# EAGLE design power-distribution (EAGLE 6.4)
AUTHOR: Ryan Julian (ryanjulian@berkeley.edu); DESIGN_NAME: Exynos Backpack; REVISION: A; YEAR: 2013
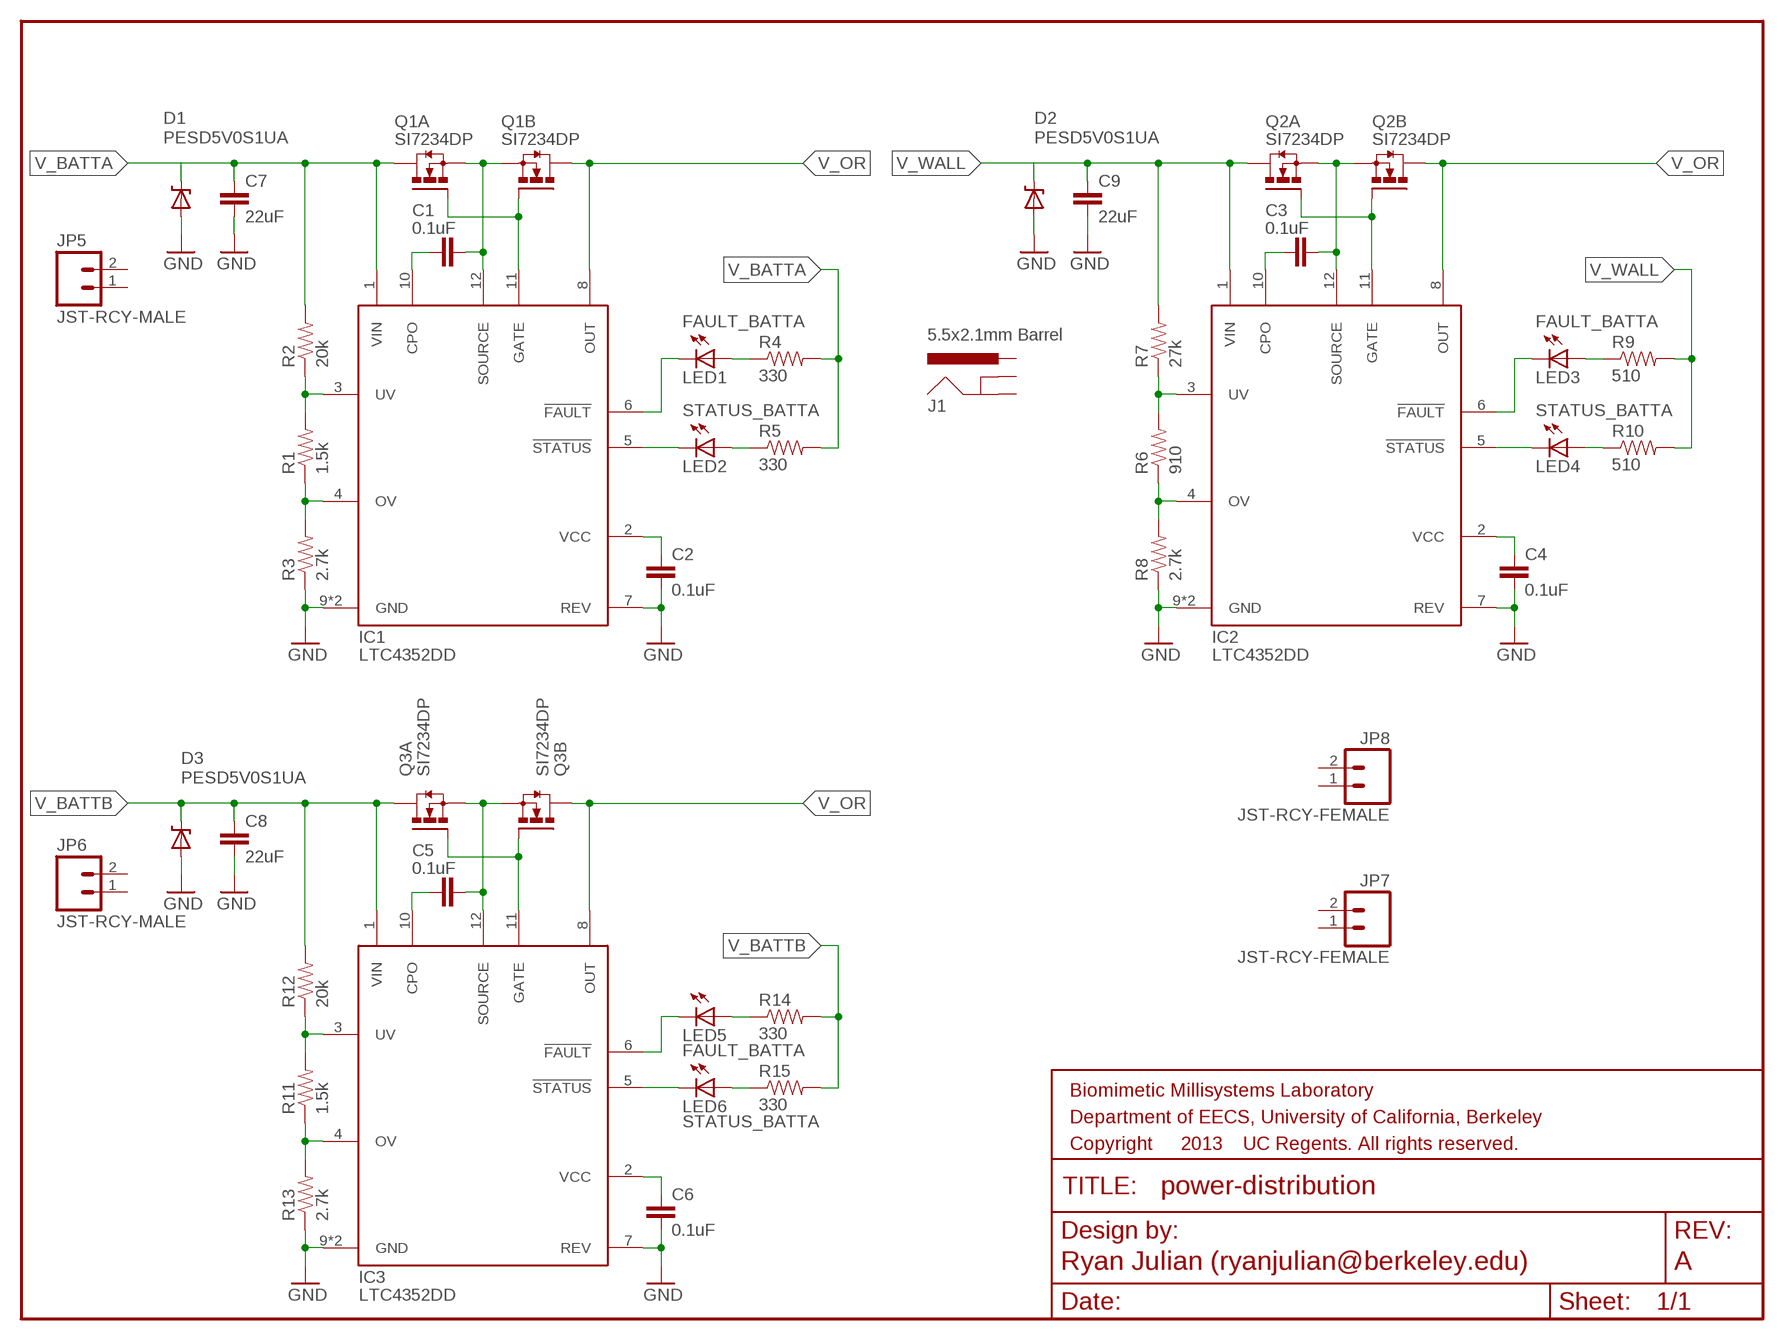
[diagram p0: schematic, sheet 1]

## Parts
C1  0.1uF  CAP0402-CAP  [0402-CAP]
C2  0.1uF  CAP0402-CAP  [0402-CAP]
C3  0.1uF  CAP0402-CAP  [0402-CAP]
C4  0.1uF  CAP0402-CAP  [0402-CAP]
C5  0.1uF  CAP0402-CAP  [0402-CAP]
C6  0.1uF  CAP0402-CAP  [0402-CAP]
C7  22uF  CAP0603-CAP  [0603-CAP]
C8  22uF  CAP0603-CAP  [0603-CAP]
C9  22uF  CAP0603-CAP  [0603-CAP]
D1  PESD5V0S1UA  [SOD-323]
D2  PESD5V0S1UA  [SOD-323]
D3  PESD5V0S1UA  [SOD-323]
IC1  LTC4352DD  [DFN-12-3X3-DD]
IC2  LTC4352DD  [DFN-12-3X3-DD]
IC3  LTC4352DD  [DFN-12-3X3-DD]
J1  5.5x2.1mm Barrel  POWER_JACKSMD  [POWER_JACK_SMD]
JP5  JST-RCY-MALE  [JST-RCY-MALE]
JP6  JST-RCY-MALE  [JST-RCY-MALE]
JP7  JST-RCY-FEMALE  [JST-RCY-FEMALE]
JP8  JST-RCY-FEMALE  [JST-RCY-FEMALE]
LED1  FAULT_BATTA  LED0603  [LED-0603]
LED2  STATUS_BATTA  LED0603  [LED-0603]
LED3  FAULT_BATTA  LED0603  [LED-0603]
LED4  STATUS_BATTA  LED0603  [LED-0603]
LED5  FAULT_BATTA  LED0603  [LED-0603]
LED6  STATUS_BATTA  LED0603  [LED-0603]
Q1  SI7234DP  [POWERPAK-SO-8-DUAL]
Q2  SI7234DP  [POWERPAK-SO-8-DUAL]
Q3  SI7234DP  [POWERPAK-SO-8-DUAL]
R1  1.5k  RESISTOR0402-RES  [0402-RES]
R2  20k  RESISTOR0402-RES  [0402-RES]
R3  2.7k  RESISTOR0402-RES  [0402-RES]
R4  330  RESISTOR0402-RES  [0402-RES]
R5  330  RESISTOR0402-RES  [0402-RES]
R6  910  RESISTOR0402-RES  [0402-RES]
R7  27k  RESISTOR0402-RES  [0402-RES]
R8  2.7k  RESISTOR0402-RES  [0402-RES]
R9  510  RESISTOR0402-RES  [0402-RES]
R10  510  RESISTOR0402-RES  [0402-RES]
R11  1.5k  RESISTOR0402-RES  [0402-RES]
R12  20k  RESISTOR0402-RES  [0402-RES]
R13  2.7k  RESISTOR0402-RES  [0402-RES]
R14  330  RESISTOR0402-RES  [0402-RES]
R15  330  RESISTOR0402-RES  [0402-RES]

## Nets
GND: C2.2 C4.2 C6.2 C7.2 C8.2 C9.2 D1.2(A) D2.2(A) D3.2(A) IC1.7(REV) IC1.9(GND) IC1.PAD(GND) IC2.7(REV) IC2.9(GND) IC2.PAD(GND) IC3.7(REV) IC3.9(GND) IC3.PAD(GND) R3.1 R8.1 R13.1
N$1: C1.2 IC1.12(SOURCE) Q1.1(A:S) Q1.3(B:S)
N$2: IC1.11(GATE) Q1.2(A:G) Q1.4(B:G)
N$4: C1.1 IC1.10(CPO)
N$6: IC1.3(UV) R1.2 R2.1
N$7: IC1.4(OV) R1.1 R3.2
N$8: C2.1 IC1.2(VCC)
N$9: IC1.6(!FAULT) LED1.C
N$10: IC1.5(!STATUS) LED2.C
N$11: LED2.A R5.1
N$12: LED1.A R4.1
N$13: C3.2 IC2.12(SOURCE) Q2.1(A:S) Q2.3(B:S)
N$14: IC2.11(GATE) Q2.2(A:G) Q2.4(B:G)
N$15: C3.1 IC2.10(CPO)
N$18: IC2.3(UV) R6.2 R7.1
N$19: IC2.4(OV) R6.1 R8.2
N$20: C4.1 IC2.2(VCC)
N$21: IC2.6(!FAULT) LED3.C
N$22: IC2.5(!STATUS) LED4.C
N$23: LED4.A R10.1
N$24: LED3.A R9.1
N$25: C5.2 IC3.12(SOURCE) Q3.1(A:S) Q3.3(B:S)
N$26: IC3.11(GATE) Q3.2(A:G) Q3.4(B:G)
N$27: C5.1 IC3.10(CPO)
N$30: IC3.3(UV) R11.2 R12.1
N$31: IC3.4(OV) R11.1 R13.2
N$32: C6.1 IC3.2(VCC)
N$33: IC3.6(!FAULT) LED5.C
N$34: IC3.5(!STATUS) LED6.C
N$35: LED6.A R15.1
N$36: LED5.A R14.1
V_BATTA: C7.1 D1.1(C) IC1.1(VIN) Q1.7+8(A:D) R2.2 R4.2 R5.2
V_BATTB: C8.1 D3.1(C) IC3.1(VIN) Q3.7+8(A:D) R12.2 R14.2 R15.2
V_OR: IC1.8(OUT) IC2.8(OUT) IC3.8(OUT) Q1.5+6(B:D) Q2.5+6(B:D) Q3.5+6(B:D)
V_WALL: C9.1 D2.1(C) IC2.1(VIN) Q2.7+8(A:D) R7.2 R9.2 R10.2
Unconnected: J1.GND(GNDBREAK) J1.P$4(GND) J1.VIN0(PWR) JP5.1 JP5.2 JP6.1 JP6.2 JP7.1 JP7.2 JP8.1 JP8.2

## Library data of the parts
C1-C9 = biomimetic:CAP: Capacitor Standard 0603 ceramic capacitor, and 0.1" leaded capacitor.
D1-D3 = biomimetic:PESD5V0S1UA: NXP PESD5V0S1UA Unidirectional ESD protection for transient voltage suppression for 5V devices Digi-Key P/N: 568-7351-1-ND
IC1-IC3 = biomimetic:LTC4352: Low Voltage Ideal Diode Controller with Monitoring
J1 = biomimetic:POWER_JACK: Power Jack This is the standard 5.5mm barrel jack for power. The PTH is the most common, proven, reliable, footprint. The Slot footprint only works if the mill layer is transmitted to the PCB fab house so be warned. Spark Fun Electronics SKU : PRT-00119 SMT: CONN-08106 Mating wall wart : TOL-00298 (and others); PROD_ID: CONN-08106
JP5 JP6 = biomimetic:JST-RCY-MALE: JST RCY male pigtail connector
JP7 JP8 = biomimetic:JST-RCY-FEMALE
LED1-LED6 = biomimetic:LED: LEDs Standard schematic elements and footprints for 5mm, 3mm, 1206, and 0603 sized LEDs. 5mm - Spark Fun Electronics SKU : COM-00529 (and others)
Q1-Q3 = biomimetic:SI7234DP: Vishay Siliconix Dual N-Channel 12-V (D-S) MOSFET
R1-R15 = biomimetic:RESISTOR: Resistor Basic schematic elements and footprints for 0603, 1206, and PTH resistors.

## Net classes
1 sup: width 0.254 mm

## Board
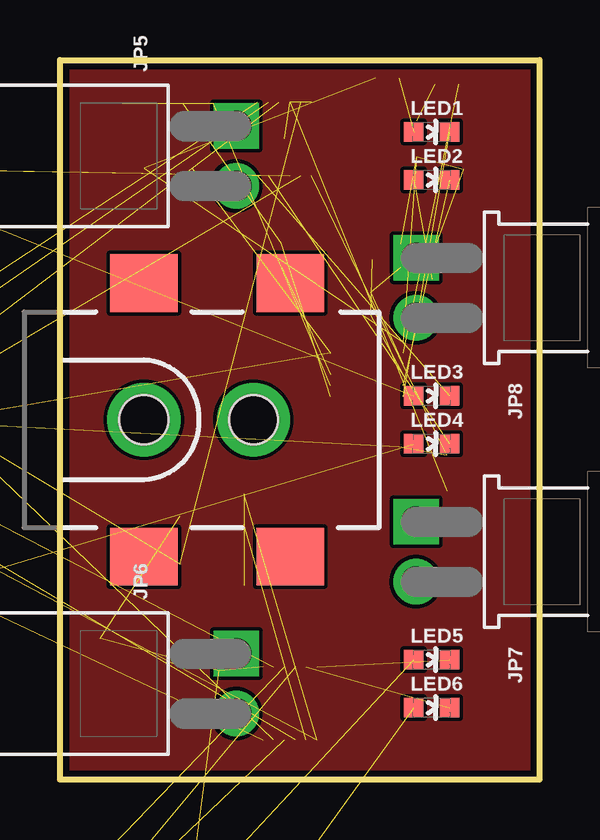
[diagram p1: board, top side]
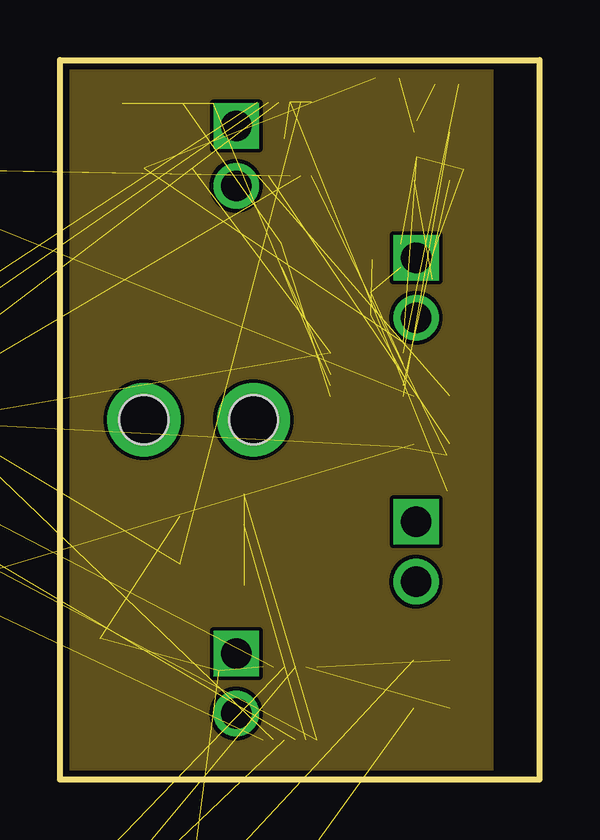
[diagram p2: board, inner layer Ground]
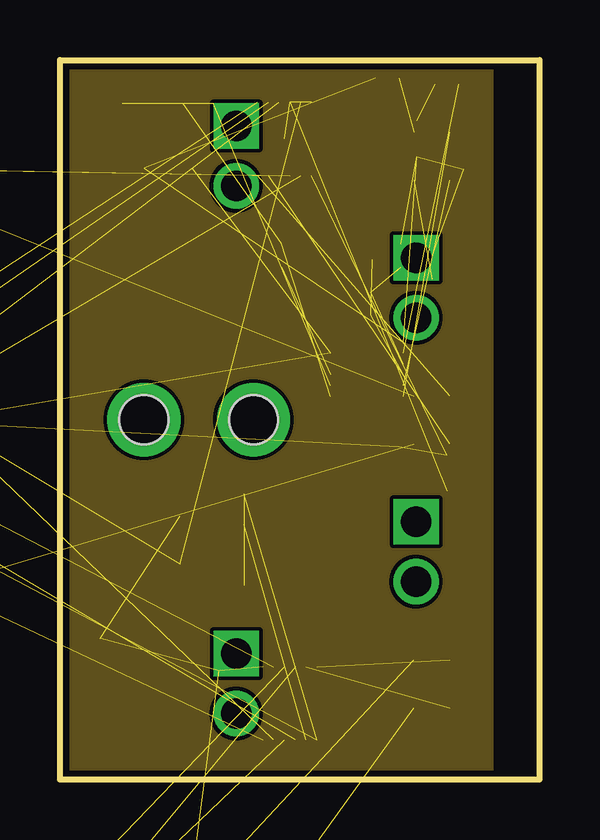
[diagram p3: board, inner layer Power]
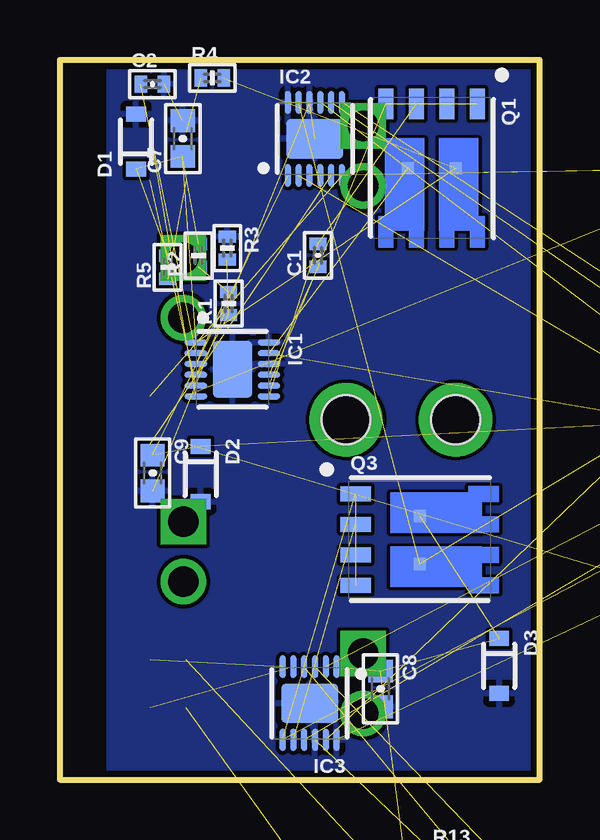
[diagram p4: board, bottom side, seen from below]

Size 20 x 30 mm. Coordinates in mm from the lower left corner, seen from the top.
Outline: 20,0 20,30 0,30 0,0 20,0
Copper layers (1*2+3*16): Top 2mil / dielectric 9mil / Ground 2mil / dielectric 40mil / Power 2mil / dielectric 9mil / Bottom 2mil
Design rules "advancedcircuits-66each-biomimetic": minimum track width 6mil, minimum drill 15mil, track to track 6mil, track to pad 6mil, pad to pad 6mil, via to via 6mil, smd to smd 6mil, copper to edge 10mil, drill to drill 7mil, minimum pad ring 7mil, minimum via ring 7mil, stop-mask expansion 3mil, vias tented up to drill 0mil, thermal gap 10mil
tKeepout: 4 lines
bKeepout: 4 lines

### Footprints (pad centres in the part's own frame; a part is rotated, then mirrored left to right if it is on the bottom)
0402-CAP = smd 0.508 x 0.711: 1 -0.483,0; 2 0.483,0
0603-CAP = smd 0.94 x 1.016: 1 -0.749,0; 2 0.749,0
SOD-323 = smd 0.63 x 0.83: 1 -1.15,0; 2 1.15,0
DFN-12-3X3-DD = smd 0.25 x 0.95: 1 -1.125,-1.525; 2 -0.675,-1.525; 3 -0.225,-1.525; 4 0.225,-1.525; 5 0.675,-1.525; 6 1.125,-1.525; 7 -1.125,1.525; 8 -0.675,1.525; 9 -0.225,1.525; 10 0.225,1.525; 11 0.675,1.525; 12 1.125,1.525 | smd 2.38 x 1.65: PAD 0,0
POWER_JACK_SMD = smd 2.8 x 2.4: GND 0,-5.7; P$4 6.1,-5.7; VIN0 0,5.7; VIN1 6.1,5.7 | hole 2.032: 0,0; 4.572,0
JST-RCY-MALE = drill 1.27 square: 1 1.25,-7.35 | drill 1.27: 2 -1.25,-7.35
JST-RCY-FEMALE = drill 1.27 square: 1 -1.25,-3.15 | drill 1.27: 2 1.25,-3.15
LED-0603 = smd 0.8 x 0.8: A 0,-0.75; C 0,0.75
POWERPAK-SO-8-DUAL = smd 1.27 x 0.61: 1 -2.67,1.905; 2 -2.67,0.635; 3 -2.67,-0.635; 4 -2.67,-1.905 | smd 0.5 x 0.5: 5+6 0,-1; 7+8 0,1
0402-RES = smd 0.508 x 0.711: 1 -0.483,0; 2 0.483,0

### Placement (x,y rotation side)
C1  9.24,21.85 90 bottom
C2  16.15,28.99 0 bottom
C3  -9.52,14.44 0 bottom  (outside the outline)
C4  -12.9,11.94 0 bottom  (outside the outline)
C5  -7.02,11.33 0 bottom  (outside the outline)
C6  -14.9,16.83 0 bottom  (outside the outline)
C7  14.88,26.72 90 bottom
C8  6.63,3.78 270 bottom
C9  16.13,12.78 270 bottom
D1  16.82,26.59 90 bottom
D2  14.13,12.73 270 bottom
D3  1.69,4.74 270 bottom
IC1  12.81,17.1 270 bottom
IC2  9.37,26.71 0 bottom
IC3  9.59,3.18 180 bottom
J1  3.5,15 0 top
JP5  0,26 90 top
JP6  0,4 90 top
JP7  18,9.5 270 top
JP8  18,20.5 270 top
LED1  15.5,27 270 top
LED2  15.5,25 270 top
LED3  15.5,16 270 top
LED4  15.5,14 270 top
LED5  15.5,5 270 top
LED6  15.5,3 270 top
Q1  4.5,25.5 270 bottom
Q2  -6,15 270 bottom  (outside the outline)
Q3  5,10 0 bottom
R1  12.96,19.84 90 bottom
R2  14.22,21.84 90 bottom
R3  13.02,22.16 270 bottom
R4  13.65,29.25 0 bottom
R5  15.51,21.35 90 bottom
R6  -16.85,25.58 0 bottom  (outside the outline)
R7  -14.41,25.58 0 bottom  (outside the outline)
R8  -11.97,25.58 0 bottom  (outside the outline)
R9  -9.54,25.58 0 bottom  (outside the outline)
R10  -13.19,5.77 0 bottom  (outside the outline)
R11  13.7,-4.38 0 bottom  (outside the outline)
R12  0.64,-3.88 0 bottom  (outside the outline)
R13  3.58,-3.38 0 bottom  (outside the outline)
R14  6.02,-3.88 0 bottom  (outside the outline)
R15  8.96,-4.38 0 bottom  (outside the outline)
U$12  [CAL_LOGO]  58.79,2.9 0 bottom  (outside the outline)

### Tracks (layer width: path | path; a pad name or v marks a point on that pad's centre or on a via)
GND  (8 unrouted)
  pour Top: 0,30 20,30 20,0 0,0
  pour Ground: 0,30 18,30 18,0 0,0
  pour Bottom: 0,30 18,30 18,0 15,0 0,0.11
N$1  (3 unrouted)
N$2  (2 unrouted)
N$3  (via drill 2.03)
  other vias: 3.5,15
N$4  (1 unrouted)
N$5  (via drill 2.03)
  other vias: 8.07,15
N$6  (2 unrouted)
N$7  (2 unrouted)
N$8  (1 unrouted)
N$9  (1 unrouted)
N$10  (1 unrouted)
N$11  (1 unrouted)
N$12  (1 unrouted)
N$13  (3 unrouted)
N$14  (2 unrouted)
N$15  (1 unrouted)
N$18  (2 unrouted)
N$19  (2 unrouted)
N$20  (1 unrouted)
N$21  (1 unrouted)
N$22  (1 unrouted)
N$23  (1 unrouted)
N$24  (1 unrouted)
N$25  (3 unrouted)
N$26  (2 unrouted)
N$27  (1 unrouted)
N$30  (2 unrouted)
N$31  (2 unrouted)
N$32  (1 unrouted)
N$33  (1 unrouted)
N$34  (1 unrouted)
N$35  (1 unrouted)
N$36  (1 unrouted)
V_BATT
  pour Power: 0,30 18,30 18,0 15,0 15,0.11 0,0.11
V_BATTA  (6 unrouted)
V_BATTB  (6 unrouted)
V_OR  (5 unrouted)
V_WALL  (6 unrouted)

### Text on the board
tPlace: Ryan Julian | Biomimetic | Laboratory | Millisystems | 2013.02.16 | GO BEARS! | Exynos Backpack 1.0 Rev. A